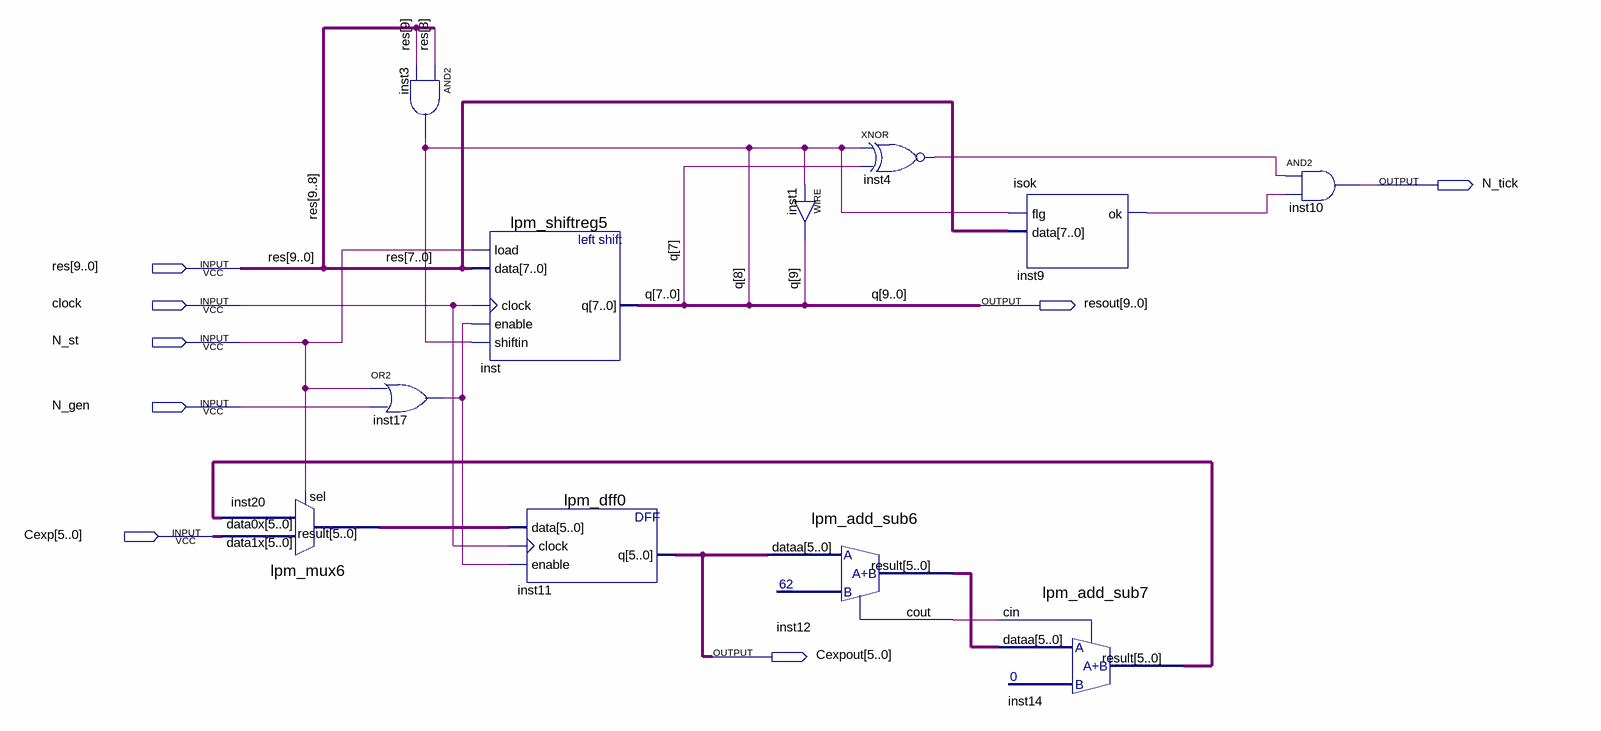
[diagram p0: schematic sheet]
// Quartus schematic normMantiss.bdf as structural Verilog: 11 symbols, 8 pins
module normMantiss (
  input  [9:0] res,
  input  clock,
  input  N_st,
  input  N_gen,
  input  [5:0] Cexp,
  output N_tick,
  output [9:0] resout,
  output [5:0] Cexpout
);

  wire inst4_out, inst9_ok, inst12_cout, inst17_out;
  wire [5:0] inst12_result, inst14_result, inst20_result;

  lpm_mux6 inst20 (.data1x(Cexp), .data0x(inst14_result), .sel(N_st), .result(inst20_result));
  or inst17 (inst17_out, N_st, N_gen);
  and inst3 (resout[8], res[8], res[9]);
  lpm_shiftreg5 inst (
    .load(N_st), .data(res[7:0]), .clock(clock), .enable(inst17_out), .shiftin(resout[8]), .q(resout[7:0]));
  lpm_dff0 inst11 (.data(inst20_result), .clock(clock), .enable(inst17_out), .q(Cexpout));
  assign resout[9] = resout[8];  // WIRE inst1
  lpm_add_sub6 inst12 (.dataa(Cexpout), .result(inst12_result), .cout(inst12_cout));
  xnor inst4 (inst4_out, resout[8], resout[7]);
  isok inst9 (.flg(resout[8]), .data(res[7:0]), .ok(inst9_ok));
  lpm_add_sub7 inst14 (.dataa(inst12_result), .cin(inst12_cout), .result(inst14_result));
  and inst10 (N_tick, inst4_out, inst9_ok);

  // Other names for the same wires on the sheet: q[9:0] = resout
endmodule
